# EAGLE design RFM50_Breakout_3 (EAGLE 6.5.0)
HopeRF's RFM50 module Breakout-board
AUTHOR: Pasakorn Tiwatthanont
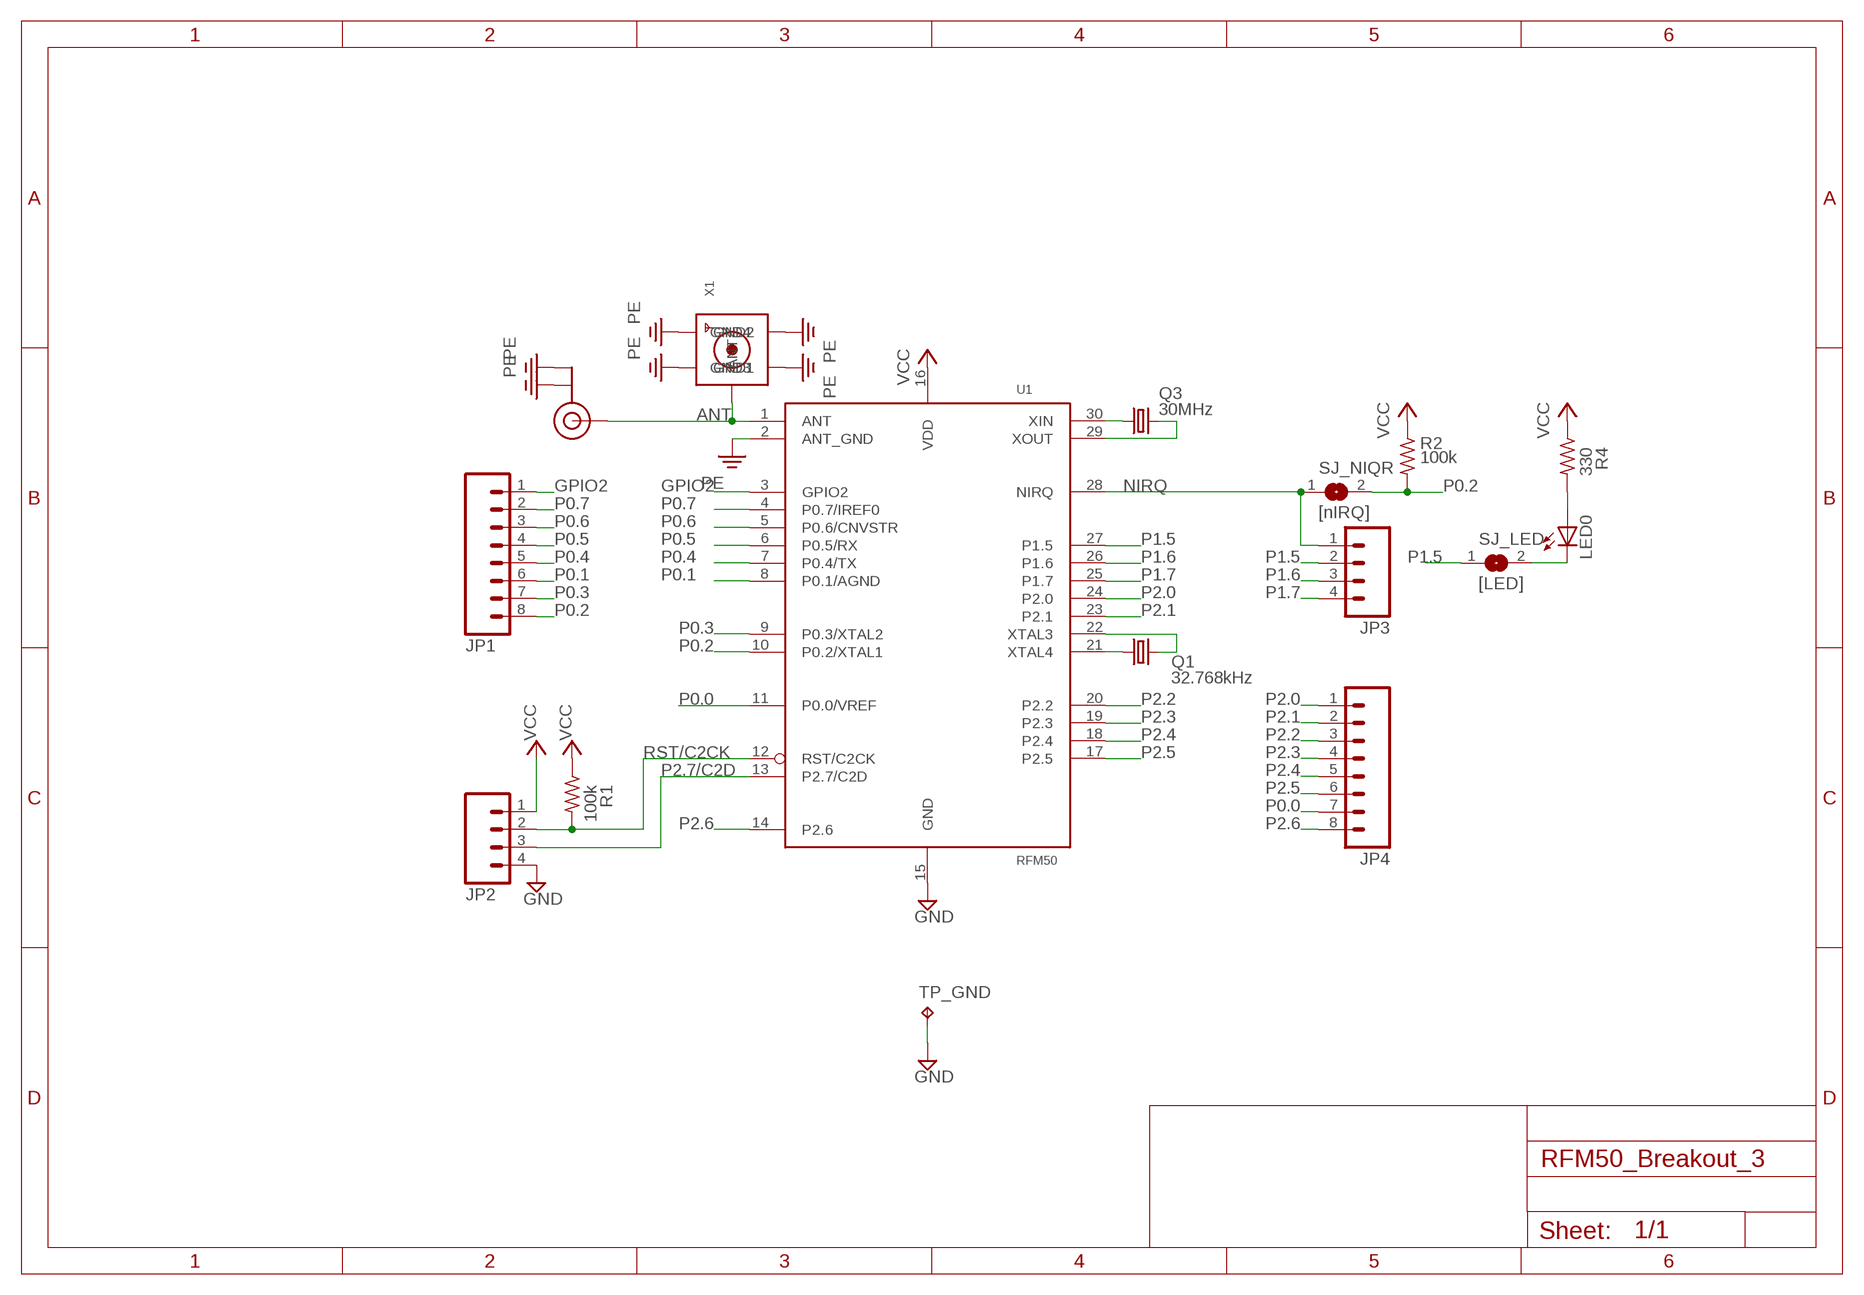
[diagram p0: schematic, sheet 1]

## Parts
JP1  M081X08  [1X08]
JP2  M04PTH  [1X04]
JP3  M04PTH  [1X04]
JP4  M081X08  [1X08]
LED0  LED3MM  [LED3MM]
Q1  32.768kHz  CRYSTALTC26H  [TC26H]
Q3  30MHz  CRYSTALHC49S  [HC49/S]
R1  100k  RCL_R-US_0204/7  [RCL_0204/7]
R2  100k  RCL_R-US_M1206  [RCL_M1206]
R4  330  RCL_R-US_0204/5  [RCL_0204/5]
SJ_LED  [LED]  SOLDERJUMPERREFLOW  [SOLDERJUMPER_REFLOW]
SJ_NIQR  [nIRQ]  SOLDERJUMPERREFLOW  [SOLDERJUMPER_REFLOW]
TP_GND  TPPAD1-10  [P1-10_TP]
U1  RFM50  [RFM50]
U$1  U.FL  [U.FL]
X1  SMACONNECTOR  [SMA90_DIP]

## Nets
ANT: U1.1(ANT) U$1.P$3(SIGNAL) X1.ANTENNA(ANT)
GND: JP2.4 TP_GND.TP U1.15(GND)
GPIO2: JP1.1 U1.3(GPIO2)
N$1: LED0.A R4.2
N$2: LED0.K(C) SJ_LED.2
N$3: Q1.1 U1.21(XTAL4)
N$4: Q3.1 U1.30(XIN)
N$5: Q3.2 U1.29(XOUT)
N$7: Q1.2 U1.22(XTAL3)
NIRQ: JP3.1 SJ_NIQR.1 U1.28(NIRQ)
P0.0: JP4.7 U1.11(P0.0/VREF)
P0.1: JP1.6 U1.8(P0.1/AGND)
P0.2: JP1.8 R2.2 SJ_NIQR.2 U1.10(P0.2/XTAL1)
P0.3: JP1.7 U1.9(P0.3/XTAL2)
P0.4: JP1.5 U1.7(P0.4/TX)
P0.5: JP1.4 U1.6(P0.5/RX)
P0.6: JP1.3 U1.5(P0.6/CNVSTR)
P0.7: JP1.2 U1.4(P0.7/IREF0)
P1.5: JP3.2 SJ_LED.1 U1.27(P1.5)
P1.6: JP3.3 U1.26(P1.6)
P1.7: JP3.4 U1.25(P1.7)
P2.0: JP4.1 U1.24(P2.0)
P2.1: JP4.2 U1.23(P2.1)
P2.2: JP4.3 U1.20(P2.2)
P2.3: JP4.4 U1.19(P2.3)
P2.4: JP4.5 U1.18(P2.4)
P2.5: JP4.6 U1.17(P2.5)
P2.6: JP4.8 U1.14(P2.6)
P2.7/C2D: JP2.3 U1.13(P2.7/C2D)
PE: U1.2(ANT_GND) U$1.P$1(GND) U$1.P$2(GND) X1.GND1 X1.GND2 X1.GND3 X1.GND4
RST/C2CK: JP2.2 R1.2 U1.12(RST/C2CK)
VCC: JP2.1 R1.1 R2.1 R4.1 U1.16(VDD)

## Library data of the parts
JP1 JP4 = SparkFun-Connectors:M08: Header 8 Standard 8-pin 0.1" header. Use with straight break away headers (SKU : PRT-00116), right angle break away headers (PRT-00553), swiss pins (PRT-00743), machine pins (PRT-00117), and female headers (PRT-00115).
JP2 JP3 = ipas:M04: Header 4 Standard 4-pin 0.1" header. Use with straight break away headers (SKU : PRT-00116), right angle break away headers (PRT-00553), swiss pins (PRT-00743), machine pins (PRT-00117), and female headers (PRT-00115). Molex polarized connector foot print use with SKU : PRT-08231 with associated crimp pins and housings. 1MM SMD Version SKU: PRT-10208
LED0 = led:LED: LED OSRAM: - CHIPLED LG R971, LG N971, LY N971, LG Q971, LY Q971, LO R971, LY R971 LH N974, LH R974 LS Q976, LO Q976, LY Q976 LO Q996 - Hyper CHIPLED LW Q18S LB Q993, LB Q99A, LB R99A - SideLED LS A670, LO A670, LY A670, LG A670, LP A670 LB A673, LV A673, LT A673, LW A673 LH A674 LY A675 LS A676, LA A676, LO A676, LY A676, LW A676 LS A679, LY A679, LG A679 - Hyper Micro SIDELED® LS Y876, LA Y876, LO Y876, LY Y876 LT Y87S - SmartLED LW L88C, LW L88S LB L89C, LB L89S, LG L890 LS L89K, LO L89K, LY L89K LS L896, LA L896, LO L896, LY L896 - TOPLED LS T670, LO T670, LY T670, LG T670, LP T670 LSG T670, LSP T670, LSY T670, LOP T670, LYG T670 LG T671, LOG T671, LSG T671 LB T673, LV T673, LT T673, LW T673 LH T674 LS T676, LA T676, LO T676, LY T676, LB T676, LH T676, LSB T676, LW T676 LB T67C, LV T67C, LT T67C, LS T67K, LO T67K, LY T67K, LW E67C LS E67B, LA E67B, LO E67B, LY E67B, LB E67C, LV E67C, LT E67C LW T67C LS T679, LY T679, LG T679 LS T770, LO T770, LY T770, LG T770, LP T770 LB T773, LV T773, LT T773, LW T773 LH T774 LS E675, LA E675, LY E675, LS T675 LS T776, LA T776, LO T776, LY T776, LB T776 LHGB T686 LT T68C, LB T68C - Hyper Mini TOPLED® LB M676 - Mini TOPLED Santana® LG M470 LS M47K, LO M47K, LY M47K Source: http://www.osram.convergy.de LUXEON: - LUMILED® LXK2-PW12-R00, LXK2-PW12-S00, LXK2-PW14-U00, LXK2-PW14-V00 LXK2-PM12-R00, LXK2-PM12-S00, LXK2-PM14-U00 LXK2-PE12-Q00, LXK2-PE12-R00, LXK2-PE12-S00, LXK2-PE14-T00, LXK2-PE14-U00 LXK2-PB12-K00, LXK2-PB12-L00, LXK2-PB12-M00, LXK2-PB14-N00, LXK2-PB14-P00, LXK2-PB14-Q00 LXK2-PR12-L00, LXK2-PR12-M00, LXK2-PR14-Q00, LXK2-PR14-R00 LXK2-PD12-Q00, LXK2-PD12-R00, LXK2-PD12-S00 LXK2-PH12-R00, LXK2-PH12-S00 LXK2-PL12-P00, LXK2-PL12-Q00, LXK2-PL12-R00 Source: www.luxeon.com KINGBRIGHT: KA-3528ASYC Source: www.kingbright.com
Q1 = crystal:CRYSTAL: CRYSTAL; OC_FARNELL: unknown; OC_NEWARK: unknown
Q3 = crystal:CRYSTAL: CRYSTAL; OC_FARNELL: 1667008; OC_NEWARK: unknown
R1 R2 R4 = ipas:RCL_R-US_: RESISTOR, American symbol
SJ_LED SJ_NIQR = ipas:SOLDERJUMPER: SMD Solder JUMPER Solder the two pads together to create a connection, or remove the solder to break it. REFLOW - Use this footprint for solder paste and reflow ovens. WAVE - Use this footprint for hand-soldering (larger pads). CLOSED - Has a trace between the two pads to ensure it is closed by default. The trace needs to be cut to disable the jumper, and can be closed again by creating a solder bridge between the two pads.
TP_GND = ipas:TP: Test pad
U1 = ipas:RFM50: RFM50 Module for Silabs Wireless SoC, Si1000.
U$1 = microbuilder:U.FL: U.FL Antenna Connector
X1 = ipas:SMACONNECTOR: SMA Connector 90° DIP SMA Connector, 50 Ohm (4UConnector: 07259)

## Net classes
0 default: width 0.254 mm, drill 0.254 mm, clearance 0.254 mm
1 power: width 0.254 mm, drill 0.254 mm, clearance 0.254 mm

## Board
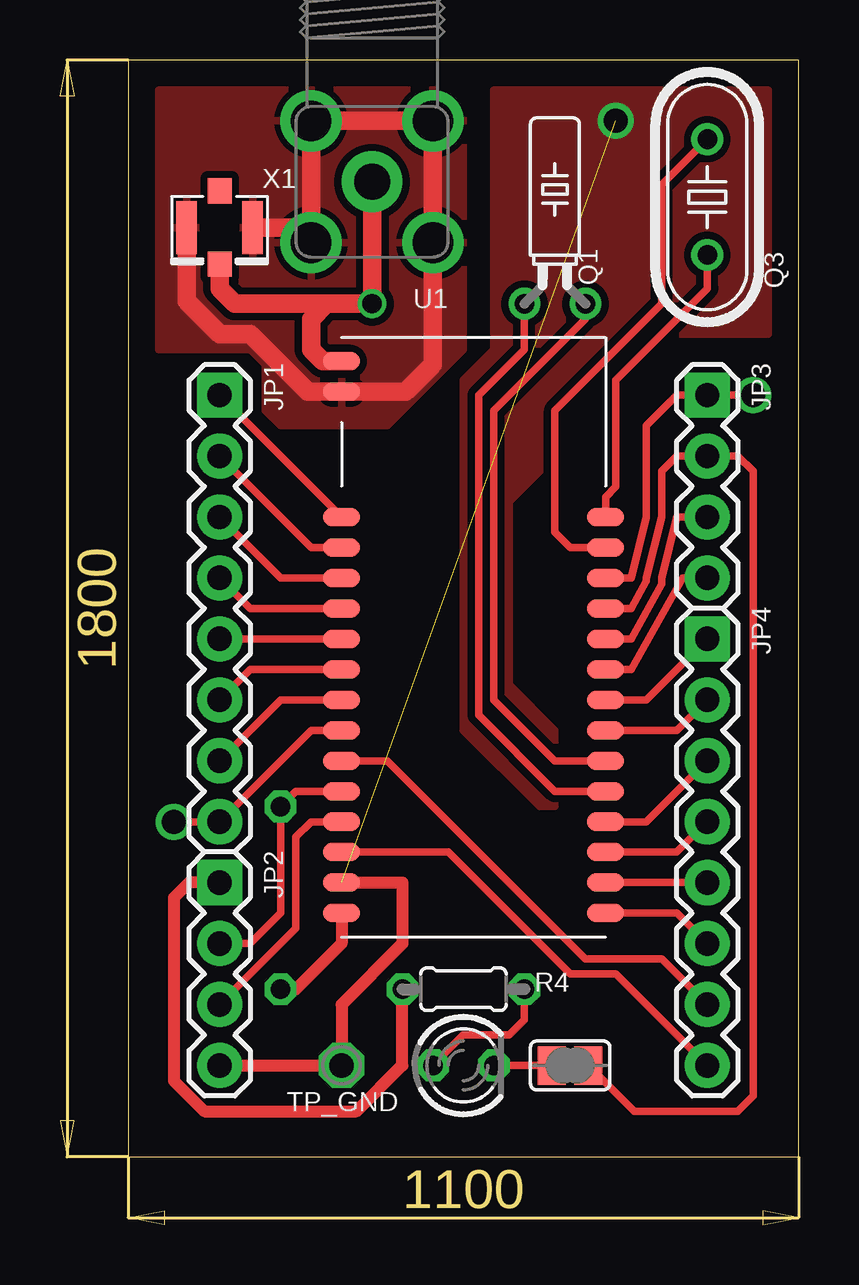
[diagram p1: board, top side]
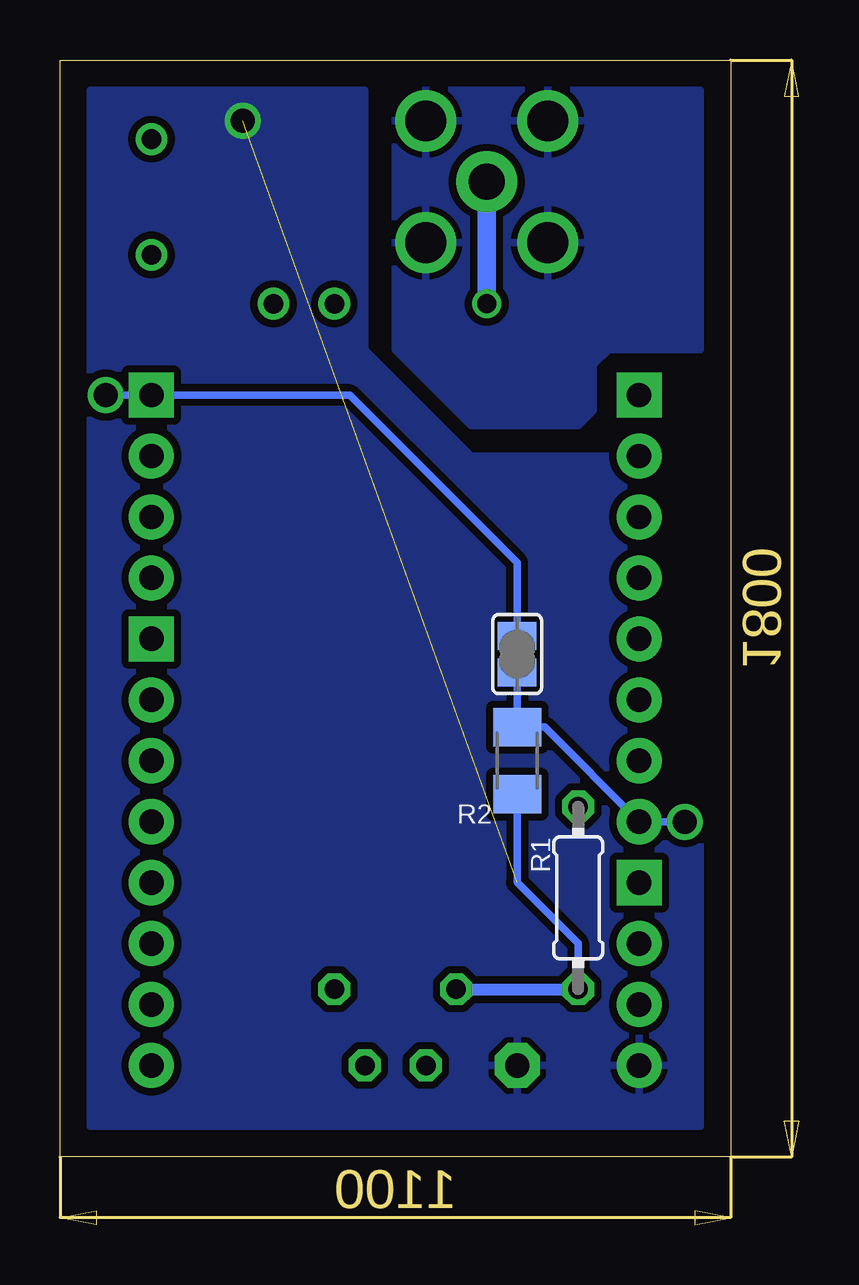
[diagram p2: board, bottom side, seen from below]

Size 27.94 x 45.72 mm. Coordinates in mm from the lower left corner, seen from the top.
Outline: 0,0 27.94,0 27.94,45.72 0,45.72 0,0
Copper layers (1*16): Top 0.035mm / dielectric 1.5mm / Bottom 0.035mm
Design rules "ipas": minimum track width 12mil, minimum drill 24mil, track to track 12mil, track to pad 12mil, pad to pad 10mil, via to via 10mil, smd to smd 10mil, copper to edge 40mil, drill to drill 10mil, minimum pad ring 10mil, minimum via ring 8mil, stop-mask expansion 4mil, vias tented up to drill 0mil, thermal gap 10mil

### Footprints (pad centres in the part's own frame; a part is rotated, then mirrored left to right if it is on the bottom)
1X08 = drill 1.016 pad 1.88 square: 1 0,0 | drill 1.016 pad 1.88: 2 2.54,0; 3 5.08,0; 4 7.62,0; 5 10.16,0; 6 12.7,0; 7 15.24,0; 8 17.78,0
1X04 = drill 1.016 pad 1.88 square: 1 0,0 | drill 1.016 pad 1.88: 2 2.54,0; 3 5.08,0; 4 7.62,0
LED3MM = drill 0.813 octagon: A -1.27,0; K 1.27,0
TC26H = drill 0.813: 1 -1.27,0; 2 1.27,0
HC49/S = drill 0.813: 1 -2.413,0; 2 2.413,0
RCL_0204/7 = drill 0.813 octagon: 1 -3.81,0; 2 3.81,0
RCL_M1206 = smd 1.6 x 2: 1 -1.4,0; 2 1.4,0
RCL_0204/5 = drill 0.813 octagon: 1 -2.54,0; 2 2.54,0
SOLDERJUMPER_REFLOW = smd 1.168 x 1.6: 1 -0.762,0; 2 0.762,0
P1-10_TP = drill 1.016 pad 1.88 octagon: TP 0,0
RFM50 = smd 1.524 x 0.762: 1 0,23; 2 0,21.73; 3 0,16.51; 4 0,15.24; 5 0,13.97; 6 0,12.7; 7 0,11.43; 8 0,10.16; 9 0,8.89; 10 0,7.62; 11 0,6.35; 12 0,5.08; 13 0,3.81; 14 0,2.54; 15 0,1.27; 16 0,0; 17 11,0; 18 11,1.27; 19 11,2.54; 20 11,3.81; 21 11,5.08; 22 11,6.35; 23 11,7.62; 24 11,8.89; 25 11,10.16; 26 11,11.43; 27 11,12.7; 28 11,13.97; 29 11,15.24; 30 11,16.51
U.FL = smd 2.2 x 0.85: P$1 0,1.375; P$2 0,-1.375 | smd 1.05 x 1: P$3 1.525,0; P$4 -1.525,0
SMA90_DIP = drill 1.5 pad 2.54: ANTENNA 0,0 | drill 1.7 pad 2.54: GND1 -2.54,2.54; GND2 2.54,2.54; GND3 -2.54,-2.54; GND4 2.54,-2.54

### Placement (x,y rotation side)
JP1  3.81,31.75 270 top
JP2  3.81,11.43 270 top
JP3  24.13,31.75 270 top
JP4  24.13,21.59 270 top
LED0  13.97,3.81 0 top
Q1  17.78,35.56 0 top
Q3  24.13,40.01 90 top
R1  6.35,10.79 90 bottom
R2  8.89,16.51 90 bottom
R4  13.97,6.99 0 top
SJ_LED  18.41,3.81 180 top
SJ_NIQR  8.89,20.95 270 bottom
TP_GND  8.89,3.81 0 top
U1  8.89,10.16 0 top
U$1  3.81,38.73 270 top
X1  10.16,40.64 0 top

### Tracks (layer width: path | path; a pad name or v marks a point on that pad's centre or on a via)
ANT  (via drill 0.8)
  Top 0.762: X1.ANTENNA v10.16,35.56 8.26,35.56 | U1.1 8.12,33.16 7.62,33.66 7.62,34.92 8.26,35.56 | U$1.P$3 3.81,36.2 4.45,35.56 8.26,35.56
  Bottom 0.762: v10.16,35.56 X1.ANTENNA
GND  (via drill 1)  (1 unrouted)
  Top 0.508: JP2.4 TP_GND.TP 8.89,6.35 11.43,8.89 11.43,11.43 U1.15
  other vias: 20.32,43.18
  pour Bottom: 1.27,29.21 10.79,29.21 15.24,33.66 15.24,44.45 26.67,44.45 26.67,1.27 1.27,1.27
  pour Top: 17.78,14.61 17.14,14.61 13.97,17.78 13.97,32.38 15.24,33.66 15.24,44.45 26.67,44.45 26.67,34.29 22.86,34.29 15.88,27.3 15.88,19.68 17.78,17.78
GPIO2
  Top 0.305: JP1.1 U1.3
N$1
  Top 0.305: LED0.A 13.97,5.08 15.88,5.08 16.51,5.71 R4.2
N$2
  Top 0.305: LED0.K SJ_LED.2
N$3
  Top 0.305: U1.21 17.78,15.24 14.61,18.41 14.61,31.75 16.51,33.66 Q1.1
N$4
  Top 0.305: U1.30 19.89,27.51 20.32,27.94 20.32,32.38 24.13,36.2 Q3.1
N$5
  Top 0.305: U1.29 18.41,25.4 17.78,26.04 17.78,31.11 22.23,35.56 22.23,40.51 Q3.2
N$7
  Top 0.305: U1.22 17.78,16.51 15.24,19.05 15.24,31.11 19.05,34.92 Q1.2
NIRQ  (via drill 1)
  Top 0.305: U1.28 20.95,24.13 21.59,26.67 21.59,30.48 22.86,31.75 JP3.1 v26.04,31.75
  Bottom 0.305: v26.04,31.75 JP3.1 15.88,31.75 8.89,24.77 SJ_NIQR.1
P0.0
  Top 0.305: JP4.7 22.23,8.26 19.05,8.26 10.79,16.51 U1.11
P0.1
  Top 0.305: JP1.6 5.08,20.32 U1.8
P0.2  (via drill 1)
  Top 0.305: U1.10 7.62,17.78 JP1.8 v1.91,13.97
  Bottom 0.305: v1.91,13.97 JP1.8 7.75,17.91 R2.2 SJ_NIQR.2
P0.3
  Top 0.305: JP1.7 6.35,19.05 U1.9
P0.4
  Top 0.305: JP1.5 U1.7
P0.5
  Top 0.305: JP1.4 5.08,22.86 U1.6
P0.6
  Top 0.305: JP1.3 6.35,24.13 U1.5
P0.7
  Top 0.305: JP1.2 7.62,25.4 U1.4
P1.5
  Top 0.305: U1.27 20.95,22.86 21.59,24 21.59,24.13 22.23,26.67 22.23,28.57 22.86,29.21 JP3.2 25.4,29.21 26.04,28.57 26.04,2.54 25.4,1.91 21.08,1.91 SJ_LED.1
P1.6
  Top 0.305: U1.26 20.95,21.59 22.23,23.88 22.23,24.13 22.86,26.67 JP3.3
P1.7
  Top 0.305: U1.25 20.95,20.32 23.11,24.13 JP3.4
P2.0
  Top 0.305: U1.24 21.59,19.05 JP4.1
P2.1
  Top 0.305: U1.23 22.86,17.78 JP4.2
P2.2
  Top 0.305: U1.20 21.59,13.97 JP4.3
P2.3
  Top 0.305: U1.19 22.86,12.7 JP4.4
P2.4
  Top 0.305: U1.18 JP4.5
P2.5
  Top 0.305: U1.17 22.86,10.16 JP4.6
P2.6
  Top 0.305: U1.14 13.34,12.7 18.41,7.62 20.32,7.62 JP4.8
P2.7/C2D
  Top 0.305: JP2.3 6.99,9.53 6.99,13.34 7.62,13.97 U1.13
PE
  Top 0.762: X1.GND3 7.62,38.73 | 7.62,38.73 X1.GND1 X1.GND2 X1.GND4 12.7,33.02 11.57,31.89 U1.2 7.48,31.89 5.08,34.29 3.81,34.29 2.44,35.66 U$1.P$2 | U$1.P$1 7.62,38.73
  pour Top: 1.27,33.66 5.08,33.66 5.71,33.02 5.71,31.11 6.35,30.48 10.79,30.48 13.97,33.66 13.97,44.45 1.27,44.45
  pour Bottom: 1.27,33.66 5.08,33.66 5.71,33.02 5.71,31.11 6.35,30.48 10.79,30.48 13.97,33.66 13.97,44.45 1.27,44.45
RST/C2CK
  Top 0.305: U1.12 6.99,15.24 R1.2 6.35,10.16 5.08,8.89 JP2.2
VCC
  Top 0.508: U1.16 8.89,8.89 6.99,6.99 R1.1 | JP2.1 2.54,11.43 1.91,10.79 1.91,3.17 3.17,1.91 9.53,1.91 11.43,3.81 R4.1
  Bottom 0.305: R2.1 8.89,11.43 6.35,8.89 R1.1
  Bottom 0.508: R4.1 R1.1

### Text on the board
Document: IWING-RF50 v1.1 / iPAS'2013